# Altium schematic sheet PX4FLOW2.0_CAM_X0.SchDoc
size A4; DrawnBy: Philip Rowse
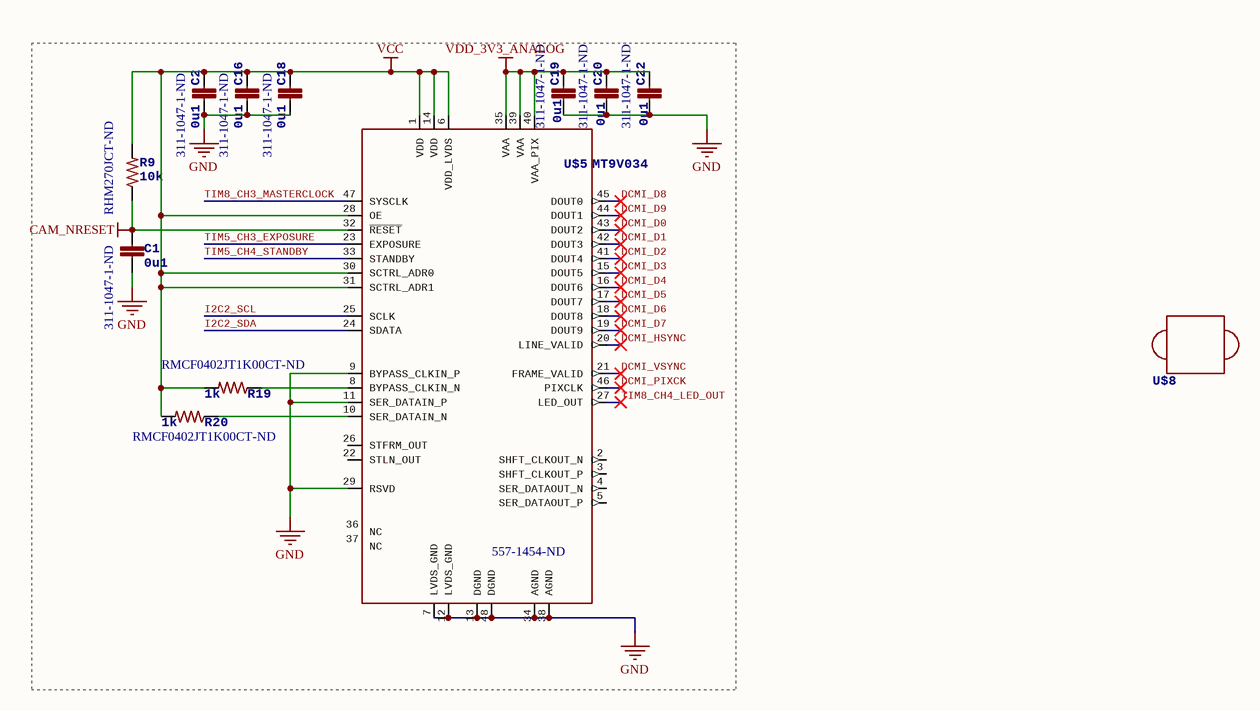
[diagram p0: PX4FLOW2.0_CAM_X0.SchDoc]

## Parts
C1  0u1  Supplier Part Number 1: 311-1047-1-ND  [0402-CAP]
C2  0u1  Supplier Part Number 1: 311-1047-1-ND  [0402-CAP]
C16  0u1  Supplier Part Number 1: 311-1047-1-ND  [0402-CAP]
C18  0u1  Supplier Part Number 1: 311-1047-1-ND  [0402-CAP]
C19  0u1  Supplier Part Number 1: 311-1047-1-ND  [0402-CAP]
C20  0u1  Supplier Part Number 1: 311-1047-1-ND  [0402-CAP]
C22  0u1  Supplier Part Number 1: 311-1047-1-ND  [0402-CAP]
R9  10k  Supplier Part Number 1: RHM270JCT-ND  [R0402]
R19  1k  Supplier Part Number 1: RMCF0402JT1K00CT-ND  [R0402]
R20  1k  Supplier Part Number 1: RMCF0402JT1K00CT-ND  [R0402]
U$5  MT9V034  Supplier Part Number 1: 557-1454-ND  [CLCC-48]
U$8  LENSMOUNT_M12  [LENSMOUNT_LARGE_M12]  (value not drawn)

## Nets
CAM_NRESET: C1.1 R9.1 U$5.32(~{RESET})
GND: C1.2 C2.2 C16.2 C18.2 C19.2 C20.2 C22.2 U$5.7(LVDS_GND) U$5.9(BYPASS_CLKIN_P) U$5.11(SER_DATAIN_P) U$5.12(LVDS_GND) U$5.13(DGND) U$5.29(RSVD) U$5.34(AGND) U$5.38(AGND) U$5.48(DGND)
VCC: C2.1 C16.1 C18.1 R9.2 R19.2 R20.2 U$5.1(VDD) U$5.6(VDD_LVDS) U$5.14(VDD) U$5.28(OE) U$5.30(SCTRL_ADR0) U$5.31(SCTRL_ADR1)
VDD_3V3_ANALOG: C19.1 C20.1 C22.1 U$5.35(VAA) U$5.39(VAA) U$5.40(VAA_PIX)
DCMI_D0: U$5.43(DOUT2)
DCMI_D1: U$5.42(DOUT3)
DCMI_D2: U$5.41(DOUT4)
DCMI_D3: U$5.15(DOUT5)
DCMI_D4: U$5.16(DOUT6)
DCMI_D5: U$5.17(DOUT7)
DCMI_D6: U$5.18(DOUT8)
DCMI_D7: U$5.19(DOUT9)
DCMI_D8: U$5.45(DOUT0)
DCMI_D9: U$5.44(DOUT1)
DCMI_HSYNC: U$5.20(LINE_VALID)
DCMI_PIXCK: U$5.46(PIXCLK)
DCMI_VSYNC: U$5.21(FRAME_VALID)
I2C2_SCL: U$5.25(SCLK)
I2C2_SDA: U$5.24(SDATA)
TIM5_CH3_EXPOSURE: U$5.23(EXPOSURE)
TIM5_CH4_STANDBY: U$5.33(STANDBY)
TIM8_CH3_MASTERCLOCK: U$5.47(SYSCLK)
TIM8_CH4_LED_OUT: U$5.27(LED_OUT)
NetR19_1: R19.1 U$5.8(BYPASS_CLKIN_N)
NetR20_1: R20.1 U$5.10(SER_DATAIN_N)

Not connected (* = marked no-connect by the designer): U$5 2(SHFT_CLKOUT_N) 3(SHFT_CLKOUT_P) 4(SER_DATAOUT_N) 5(SER_DATAOUT_P) 22(STLN_OUT) 26(STFRM_OUT) 36(NC) 37(NC)

## Notes on the sheet
- http://www.oshwa.org/
- http://creativecommons.org/licenses/by-sa/3.0/
- Title:
- Date:
- Time:
- Sheet:
- Approved:
- of:
- Drawn By:
- Checked By:
- 3DRobotics

## Library data of the parts
C1 C2 C16 C18-C20 C22 = CAP0402-CAP: CapacitorStandard 0603 ceramic capacitor, and 0.1" leaded capacitor.; PARTNO: CC0402ZRY5V7BB104; Supplier 1: Digi-Key
R9 = RESISTOR0402-RES: ResistorBasic schematic elements and footprints for 0603, 1206, and PTH 1/10th watt (small) resistors.; PARTNO: MCR01MZPJ271; Supplier 1: Digi-Key
R19 R20 = RESISTOR0402-RES: ResistorBasic schematic elements and footprints for 0603, 1206, and PTH 1/10th watt (small) resistors.; PARTNO: RMCF0402JT1K00; Supplier 1: Digi-Key
U$5 = MT9V034: PARTNO: MT9V034C12STM; Supplier 1: Digi-Key
U$8 = LENSMOUNT_M12: Point Grey compatible M12 lens mount; BOM: EXCLUDE; PARTNO: *